# Altium schematic sheet BaseBoard.SchDoc (part 2 of 2)
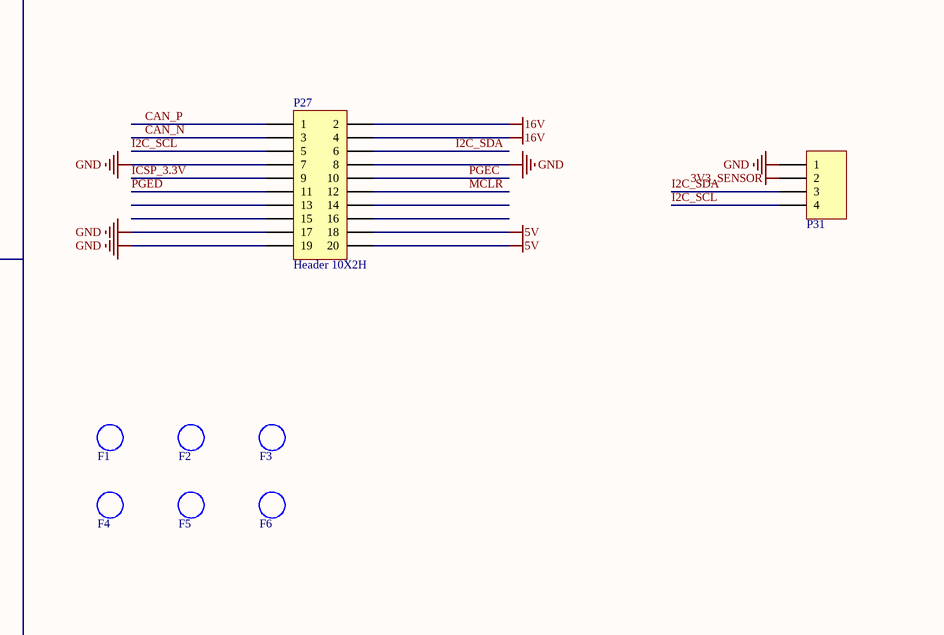
[diagram p6: BaseBoard.SchDoc, bottom right]

## Library data of the parts
C1 = CAP CER 0.1UF 50V Y5V 0603: 0.1µF -20%, +80% 50V Ceramic Capacitor Y5V (F) 0603 (1608 Metric); Manufacturer: AVX Corporation; Manufacturer Part Number: 06035G104ZAT2A; Unit Price in Quantity: .0205; Part Number: CAP CER 0.1UF 50V Y5V 0603; Component Type: Standard; Voltage - Rated: 50V; Mounting Type: smt; Supplier 1: Digikey; Supplier 1 Part Number: 478-3724-1-ND; Unit Price-Supplier 1: .11; Price Break: 1000; Vendor/Distributor: Digikey; Package: 0603
C2-C15 C18 C19 C55 = CAP CER 0.1UF 50V 10% X7R 0402: Manufacturer: TDK Corporation; Manufacturer Part Number: C1005X7R1H104K; Unit Price in Quantity: .0275; Part Number: CAP CER 0.1UF 50V 10% X7R 0402; Component Type: Standard; Mounting Type: smt; Supplier 1: Digikey; Supplier 1 Part Number: 445-5932-1-ND; Part URL-Supplier 1: http://www.digikey.com/product-detail/en/C1005X7R1H104K/445-5932-1-ND/2443972?cur=USD; Unit Price-Supplier 1: .15; Price Break: 1000; Vendor/Distributor: Digikey; DatasheetDocument: http://www.tdk.com/pdf/general_B11.pdf; Package: 0402
  C2-C15 C18 C19: Voltage - Rated: 50V
C16 C17 = CAP CERAMIC 33PF 50V NP0 0402: Manufacturer: Yageo; Manufacturer Part Number: CC0402JRNP09BN330; Unit Price in Quantity: .0019; Part Number: CAP CERAMIC 33PF 50V NP0 0402; Component Type: Standard; Voltage - Rated: 50V; Mounting Type: smt; Supplier 1: Digikey; Supplier 1 Part Number: 311-1020-1-ND; Unit Price-Supplier 1: .013; Price Break: 10000; Vendor/Distributor: Digikey; Package: 0402
C20 C21 C31 C33 C36 C39 C68 = CAP CERAMIC .01UF 50V X7R 0402: Manufacturer: Yageo; Manufacturer Part Number: CC0402KRX7R9BB103; Unit Price in Quantity: .0018; Part Number: CAP CERAMIC .01UF 50V X7R 0402; Component Type: Standard; Voltage - Rated: 50V; Mounting Type: smt; Supplier 1: Digikey; Supplier 1 Part Number: 311-1349-1-ND; Part URL-Supplier 1: http://search.digikey.com/scripts/DkSearch/dksus.dll?Detail&name=311-1349-2-ND; Unit Price-Supplier 1: .0018; Supplier 2: Digikey; Supplier 2 Part Number: GRM155R71H103KA88D; Price Break: 10000; Vendor/Distributor: Digikey; Package: 0402
C22 C35 C37 C48 = CAP CER 51PF 50V 5% NP0 0402: Manufacturer: Samsung; Manufacturer Part Number: CL05C510JB5NNNC; Unit Price in Quantity: .0117; Part Number: CAP CER 51PF 50V 5% NP0 0402; Component Type: Standard; Voltage - Rated: 50V; Mounting Type: smt; Supplier 1: Digikey; Supplier 1 Part Number: 1276-1704-1-ND; Unit Price-Supplier 1: .1; Price Break: 1000; Vendor/Distributor: Digikey; Package: 0402
C23 C41 = CAP CER 47000PF 25V X7R 0402: Manufacturer: TDK; Manufacturer Part Number: C1005X7R1E473K; Unit Price in Quantity: .0088; Part Number: CAP CER 47000PF 25V X7R 0402; Component Type: Standard; Voltage - Rated: 25V; Mounting Type: smt; Supplier 1: Digikey; Supplier 1 Part Number: 445-4941-1-ND; Unit Price-Supplier 1: .11; Price Break: 1000; Vendor/Distributor: Digikey; Package: 0402
C24 C47 = CAP 470PF 50V CERAMIC X7R 0402: Manufacturer: Yageo; Manufacturer Part Number: CC0402KRX7R9BB471; Unit Price in Quantity: .0031; Part Number: CAP 470PF 50V CERAMIC X7R 0402; Component Type: Standard; Voltage - Rated: 50V; Mounting Type: smt; Supplier 1: Digikey; Supplier 1 Part Number: 311-1028-1-ND; Unit Price-Supplier 1: .012; Price Break: 1000; Vendor/Distributor: Digikey; Package: 0402
C25-C29 C42-C46 = CAP CER 22UF 25V 20% X5R 1206: Manufacturer: Taiyo Yuden; Manufacturer Part Number: TMK316BBJ226ML-T; Unit Price in Quantity: .2169; Part Number: CAP CER 22UF 25V 20% X5R 1206; Component Type: Standard; Voltage - Rated: 25V; Mounting Type: smt; Supplier 1: Digikey; Supplier 1 Part Number: 587-3246-1-ND; Unit Price-Supplier 1: .58; Price Break: 500; Vendor/Distributor: Digikey; Package: 1210
C30 C32 C49-C51 C57-C59 C64 C71 C72 = CAP CER 1.0UF 25V X7R 0805: Manufacturer: Taiyo Yuden; Manufacturer Part Number: TMK212B7105KG-T; Unit Price in Quantity: .033; Part Number: CAP CER 1.0UF 25V X7R 0805; Component Type: Standard; Mounting Type: smt; Supplier 1: Digikey; Supplier 1 Part Number: 587-1281-1-ND; Unit Price-Supplier 1: .37; Price Break: 3000; Vendor/Distributor: Digikey; Package: 0805
  C30 C32 C71 C72: Voltage - Rated: 25V
C34 C40 = CAP CER 10UF 50V 10% X5R 1206: Manufacturer: AVX Corporation; Manufacturer Part Number: C3216X5R1H106K; Unit Price in Quantity: .396; Part Number: CAP CER 10UF 50V 10% X5R 1206; Component Type: Standard; Voltage - Rated: 50V; Mounting Type: smt; Supplier 1: Digikey; Supplier 1 Part Number: 445-5998-1-ND; Part URL-Supplier 1: http://www.digikey.com/product-detail/en/C3216X5R1H106K/445-5998-1-ND/2444039; Unit Price-Supplier 1: 1.01; Price Break: 1000; Vendor/Distributor: Digikey; DatasheetDocument: http://www.digikey.com/product-detail/en/C3216X5R1H106K/445-5998-1-ND/2444039; Package: 1206
C38 C66 = CAP CER 1UF 25V 10% X7R 0603: Manufacturer: TDK; Manufacturer Part Number: C1608X7R1E105K; Unit Price in Quantity: .0588; Part Number: CAP CER 1UF 25V 10% X7R 0603; Component Type: Standard; Mounting Type: smt; Supplier 1: Digikey; Supplier 1 Part Number: 445-5956-1-ND; Unit Price-Supplier 1: .24; Price Break: 1000; Vendor/Distributor: Digikey; Package: 0603
  C38: Voltage - Rated: 25V
C52 C60 = CAP CER 22UF 10V X5R 0805: Manufacturer: Taiyo Yuden; Manufacturer Part Number: LMK212BJ226MG-T; Unit Price in Quantity: .192; Part Number: CAP CER 22UF 10V X5R 0805; Component Type: Standard; Mounting Type: smt; Supplier 1: Digikey; Supplier 1 Part Number: 587-1958-1-ND; Part URL-Supplier 1: http://search.digikey.com/scripts/DkSearch/dksus.dll?Detail&name=587-1958-1-ND; Unit Price-Supplier 1: .96; Price Break: 3000; Vendor/Distributor: Digikey; Package: 0805
C53 C54 = CAP CERAMIC 100PF 50V NP0 0402: Manufacturer: Yageo; Manufacturer Part Number: CC0402JRNP09BN101; Unit Price in Quantity: .0032; Part Number: CAP CERAMIC 100PF 50V NP0 0402; Component Type: Standard; Mounting Type: smt; Supplier 1: Digikey; Supplier 1 Part Number: 311-1024-1-ND; Unit Price-Supplier 1: .013; Price Break: 1000; Vendor/Distributor: Digikey; Package: 0402
C56 C63 = CAP CER 10UF 25V X5R 0805: Manufacturer: Murata; Manufacturer Part Number: GRM21BR61E106KA73L; Unit Price in Quantity: .1182; Part Number: CAP CER 10UF 25V X5R 0805; Component Type: Standard; Mounting Type: smt; Supplier 1: Digikey; Supplier 1 Part Number: 490-5523-1-ND; Part URL-Supplier 1: http://www.digikey.com/product-detail/en/GRM21BR61E106KA73L/490-5523-1-ND/2334919; Unit Price-Supplier 1: .41; Price Break: 1000; Vendor/Distributor: Digikey; DatasheetDocument: http://www.murata.com/products/catalog/pdf/c02e.pdf; Package: 0805
C61 C62 = CAP CER 18PF 50V 5% NPO 0402: Manufacturer: Yageo; Manufacturer Part Number: CC0402JRNPO9BN180; Unit Price in Quantity: .0033; Part Number: CAP CER 18PF 50V 5% NPO 0402; Component Type: Standard; Mounting Type: smt; Supplier 1: Digikey; Supplier 1 Part Number: 311-1415-1-ND; Unit Price-Supplier 1: .1; Price Break: 1000; Vendor/Distributor: Digikey; Package: 0402
C65 = CAP CER 1.0UF 6.3V 10% X5R 0402: Manufacturer: Murata Electronics North America; Manufacturer Part Number: GRM155R60J105KE19D; Unit Price in Quantity: 0.006; Part Number: CAP CER 1.0UF 6.3V 10% X5R 0402; Component Type: Standard; Mounting Type: smt; Supplier 1: Digikey; Supplier 1 Part Number: 490-1320-1-ND; Part URL-Supplier 1: http://search.digikey.com/scripts/DkSearch/dksus.dll?Detail&name=490-1320-6-ND; Unit Price-Supplier 1: 0.37; Price Break: 10000; Vendor/Distributor: Digikey; Package: 0402
C67 C69 C70 = CAP CER .22UF 25V X5R 10% 0402: Manufacturer: TDK; Manufacturer Part Number: C1005X5R1E224K; Unit Price in Quantity: .03; Part Number: CAP CER .22UF 25V X5R 10% 0402; Component Type: Standard; Mounting Type: smt; Supplier 1: Digikey; Supplier 1 Part Number: 445-5944-1-ND; Unit Price-Supplier 1: .3; Price Break: 1000; Vendor/Distributor: Digikey; Package: 0402
D1 D5 D9 = 0603 绿灯: 发光二极管; ComponentLink1Description: 供应商链接; ComponentLink1URL: http://www.szlcsc.com/product/details_73152.html; Package: 0603; Supplier: LC; SuppliersPartNumber: C72043
D2 D6 D8 = 0603 蓝灯: 发光二极管; ComponentLink1Description: 供应商链接; ComponentLink1URL: http://www.szlcsc.com/product/details_73150.html; Package: 0603; Supplier: LC; SuppliersPartNumber: C72041
D3 D7 = 0603 黄灯: 发光二极管; ComponentLink1Description: 供应商链接; ComponentLink1URL: http://www.szlcsc.com/product/details_73147.html; Package: 0603; Supplier: LC; SuppliersPartNumber: C72038
D4 = 0603 红灯: 发光二极管; ComponentLink1Description: 供应商链接; ComponentLink1URL: http://www.szlcsc.com/product/details_2659.html; Package: 0603; Supplier: LC; SuppliersPartNumber: C2286
F1-F6 = Fiducial, .040": Designator: F?; Part Number: Fiducial, .040"; Component Type: Standard (No BOM)
FB1-FB4 = 0805 100Ω 25% 100MHz: 贴片磁珠; ComponentLink1Description: 供应商链接; ComponentLink1URL: http://www.szlcsc.com/product/details_1367.html; Package: 0805; Supplier: LC; SuppliersPartNumber: C1015
J1-J3 = 10117836-002LF: Usb, 3.0 Type A, Receptacle, SMT; Manufacturer: Amphenol FCI; Package: None; Manufacturer Part Number: 10117836-002LF; Digi-Key_Purchase_URL: https://www.digikey.com/product-detail/en/amphenol-fci/10117836-002LF/609-4660-ND/3641378?utm_source=snapeda&utm_medium=aggregator&utm_campaign=symbol; SnapEDA_Link: https://www.snapeda.com/parts/10117836-002LF/Amphenol%20FCI/view-part/?ref=snap; Digi-Key_Part_Number: 609-4660-ND; Value: *
L1 L2 = INDUCT ARRAY 2 COIL 3.3UH SMD: Manufacturer: Bourns Inc.; Manufacturer Part Number: SRF1280-3R3Y; Unit Price in Quantity: 1.1351; Part Number: INDUCT ARRAY 2 COIL 3.3UH SMD; Mounting Type: smt; Package: shielded; Component Type: Standard; Supplier 1: Digikey; Supplier 1 Part Number: SRF1280-3R3YCT-ND; Unit Price-Supplier 1: 1.76; Price Break: 100; Vendor/Distributor: Digikey
P1-P4 P21 P24 P25 P31 = CONN HEADER PH TOP 4POS 2MM SMD: Manufacturer: JST Sales America Inc.; Unit Price in Quantity: .3637; Part Number: CONN HEADER PH TOP 4POS 2MM SMD; Mounting Type: SMD; Package: header; Component Type: Standard; Pin Count: 4; Manufacturer Part Number: B4B-PH-SM4-TB(LF)(SN); Supplier 1: Digikey; Supplier 1 Part Number: 455-1736-1-ND; Unit Price-Supplier 1: .8; Price Break: 1000; Vendor/Distributor: Digikey
P5-P7 P13-P16 P18-P20 P23 P28-P30 = CONN HEADER PH TOP 2POS 2MM SMD: Manufacturer: JST Sales America Inc.; Unit Price in Quantity: .3467; Part Number: CONN HEADER PH TOP 2POS 2MM SMD; Mounting Type: SMD; Package: header; Component Type: Standard; Pin Count: 2; Manufacturer Part Number: B2B-PH-SM4-TB(LF)(SN); Supplier 1: Digikey; Supplier 1 Part Number: 455-1734-1-ND; Unit Price-Supplier 1: .55; Price Break: 500; Vendor/Distributor: Digikey
P8 = Header 25X2: Header, 25-Pin, Dual row; LatestRevisionDate: 17-Jul-2002; LatestRevisionNote: Re-released for DXP Platform.; Publisher: Altium Limited
P9 = CONN HEADER 2POS VL SERIES TIN: Manufacturer: JST Sales America Inc; Manufacturer Part Number: B02P-VL; Unit Price in Quantity: 0.3104; Part Number: CONN HEADER 2POS VL SERIES TIN; Mounting Type: thru-hole; Package: header; Component Type: Standard; Pin Count: 2; Supplier 1: Digikey; Supplier 1 Part Number: 455-2361-ND; Price Break: 1000; Vendor/Distributor: Digikey
P10 P12 P17 P22 P26 = CONN HEADER PH TOP 3POS 2MM SMD: Manufacturer: JST Sales America Inc.; Unit Price in Quantity: .2972; Part Number: CONN HEADER PH TOP 3POS 2MM SMD; Mounting Type: SMD; Package: header; Component Type: Standard; Pin Count: 3; Manufacturer Part Number: B3B-PH-SM4-TB(LF)(SN); Supplier 1: Digikey; Supplier 1 Part Number: 455-1735-1-ND; Unit Price-Supplier 1: .63; Price Break: 1000; Vendor/Distributor: Digikey
P11 = CONN HEADER 2POS .100" SNGL TIN: Manufacturer: Samtec Inc; Manufacturer Part Number: TSW-150-08-T-S; Unit Price in Quantity: 1.0189; Part Number: CONN HEADER 2POS .100" SNGL TIN; Mounting Type: thru-hole; Package: header; Component Type: Standard; Pin Count: 2; Supplier 1: Digikey; Supplier 1 Part Number: SAM1050-50-ND; Unit Price-Supplier 1: 2.24; Price Break: 1000; Vendor/Distributor: Digikey
P27 = Header 10X2H: Header, 10-Pin, Dual row, Right Angle; Manufacturer Part Number: AWHW 10G-0202-T; Manufacturer: Assmann WSW Components; LatestRevisionDate: 17-Jul-2002; LatestRevisionNote: Re-released for DXP Platform.; Publisher: Altium Limited
Q1 Q2 Q4 Q7 = IRF9310TRPBF: MOSFET P-CH 30V 20A 8-SOIC; Manufacturer: International Rectifier; Unit Price in Quantity: 0.7271; Part Number: IRF9310TRPBF; Mounting Type: smt; Component Kind: P Channel MOSFET; Component Type: Standard; PackageDescription: SOIC-SN8_M; Manufacturer Part Number: IRF9310TRPBF; Package: SOIC-8; Supplier 1: Digikey; Supplier 1 Part Number: IRF9310TRPBFCT-ND; Unit Price-Supplier 1: 1.94; Price Break: 1000; Vendor/Distributor: Digikey
Q3 Q5 Q6 Q8 Q9 = AO3400A N道沟 X0YV1T SOT-23: MOS(场效应管); ComponentLink1Description: 供应商链接; ComponentLink1URL: http://www.szlcsc.com/product/details_21629.html; Package: SOT-23; Supplier: LC; SuppliersPartNumber: C20917
R1-R4 = RES 49.9 OHM 1/10W 1% 0603 SMD: Manufacturer: Yageo; Manufacturer Part Number: RC0603FR-0749R9L; Unit Price in Quantity: .0027; Part Number: RES 49.9 OHM 1/10W 1% 0603 SMD; Mounting Type: smt; Package: 0603; Component Type: Standard; Supplier 1: Digikey; Supplier 1 Part Number: 311-49.9HRCT-ND; Unit Price-Supplier 1: .014; Vendor/Distributor: Digikey; Price Break: 1000
R5 R10 R11 R50 R55 R59 R61 R63 R67 R69 R70 R72 R74 R75 = RES 10K OHM 1/10W 1% 0603 SMD: Manufacturer: Stackpole Electronics Inc; Manufacturer Part Number: RMCF0603FT10K0; Unit Price in Quantity: .0023; Part Number: RES 10K OHM 1/10W 1% 0603 SMD; Mounting Type: smt; Package: 0603; Component Type: Standard; Supplier 1: Digikey; Supplier 1 Part Number: RMCF0603FT10K0CT-ND; Part URL-Supplier 1: http://search.digikey.com/scripts/DkSearch/dksus.dll?Detail&name=RMCF0603FT10K0TR-ND; Unit Price-Supplier 1: .04; Vendor/Distributor: Digikey; Price Break: 5000
R6 R7 R54 R56 = RES 12K OHM 1/10W 1% 0603 SMD: Manufacturer: Stackpole Electronics; Manufacturer Part Number: RMCF0603FT12K0; Unit Price in Quantity: .0038; Part Number: RES 12K OHM 1/10W 1% 0603 SMD; Mounting Type: smt; Package: 0603; Component Type: Standard; Supplier 1: Digikey; Supplier 1 Part Number: RMCF0603FT12K0CT-ND; Unit Price-Supplier 1: .04; Vendor/Distributor: Digikey; Price Break: 1000
R8 R42 = RES 1M OHM 1/16W 1% 0402 SMD: Manufacturer: Stackpole Electronics; Manufacturer Part Number: RMCF0402FT1M00; Unit Price in Quantity: .0038; Part Number: RES 1M OHM 1/16W 1% 0402 SMD; Mounting Type: smt; Package: 0402; Component Type: Standard; Supplier 1: Digikey; Supplier 1 Part Number: RMCF0402FT1M00CT-ND; Part URL-Supplier 1: http://search.digikey.com/scripts/DkSearch/dksus.dll?Detail&name=RMCF0402FT1M00CT-ND; Unit Price-Supplier 1: .04; Vendor/Distributor: Digikey; Price Break: 1000
R9 R22 R24 R77 R78 = RES 0.0 OHM 1/10W 0603 SMD: Manufacturer: Stackpole Electronics Inc; Manufacturer Part Number: RMCF0603ZT0R00; Unit Price in Quantity: .0015; Part Number: RES 0.0 OHM 1/10W 0603 SMD; Mounting Type: smt; Package: 0603; Component Type: Standard; Supplier 1: Digikey; Supplier 1 Part Number: RMCF0603ZT0R00CT-ND; Part URL-Supplier 1: http://search.digikey.com/scripts/DkSearch/dksus.dll?Detail&name=RMCF0603ZT0R00TR-ND; Unit Price-Supplier 1: .02; Vendor/Distributor: Digikey; Price Break: 5000
R12-R14 R31 R64 R68 R71 R73 R76 = RES 1K OHM 1/10W 1% 0603 SMD: Manufacturer: Stackpole Electronics Inc; Manufacturer Part Number: RMCF0603FT1K00; Unit Price in Quantity: .0023; Part Number: RES 1K OHM 1/10W 1% 0603 SMD; Mounting Type: smt; Package: 0603; Component Type: Standard; Supplier 1: Digikey; Supplier 1 Part Number: RMCF0603FT1K00CT-ND; Part URL-Supplier 1: http://search.digikey.com/scripts/DkSearch/dksus.dll?Detail&name=RMCF0603FT1K00TR-ND; Unit Price-Supplier 1: .04; Vendor/Distributor: Digikey; Price Break: 5000
R15 = RES SMD 120 OHM 1% 1/10W 0603: Manufacturer: Panasonic Electronic Components; Manufacturer Part Number: ERJ-3EKF1200V; Unit Price in Quantity: .0126; Part Number: RES SMD 120 OHM 1% 1/10W 0603; Mounting Type: smt; Package: 0603; Component Type: Standard; Supplier 1: Digikey; Supplier 1 Part Number: P120HCT-ND; Unit Price-Supplier 1: .1; Vendor/Distributor: Digikey; Price Break: 1000
R16 = RES 5.76K OHM 1/10W 1% 0402 SMD: Manufacturer: Panasonic - ECG; Manufacturer Part Number: ERJ-2RKF5761X; Unit Price in Quantity: .0067; Part Number: RES 5.76K OHM 1/10W 1% 0402 SMD; Mounting Type: smt; Package: 0402; Component Type: Standard; Supplier 1: Digikey; Supplier 1 Part Number: P5.76KLCT-ND; Unit Price-Supplier 1: .06; Vendor/Distributor: Digikey; Price Break: 1000
R17 R19 R27 R28 = RES 100K OHM 1/10W 1% 0603 SMD: Manufacturer: Stackpole Electronics Inc; Manufacturer Part Number: RMCF0603FT100K; Unit Price in Quantity: .0023; Part Number: RES 100K OHM 1/10W 1% 0603 SMD; Mounting Type: smt; Package: 0603; Component Type: Standard; Supplier 1: Digikey; Supplier 1 Part Number: RMCF0603FT100KCT-ND; Part URL-Supplier 1: http://search.digikey.com/scripts/DkSearch/dksus.dll?Detail&name=RMCF0603FT100KTR-ND; Unit Price-Supplier 1: .04; Vendor/Distributor: Digikey; Price Break: 5000
R18 R32 = RES 51.0K OHM 1/10W 1% 0402 SMD: Manufacturer: Panasonic - ECG; Manufacturer Part Number: ERJ-2RKF5102X; Unit Price in Quantity: .0067; Part Number: RES 51.0K OHM 1/10W 1% 0402 SMD; Mounting Type: smt; Package: 0402; Component Type: Standard; Supplier 1: Digikey; Supplier 1 Part Number: P51.0KLCT-ND; Part URL-Supplier 1: http://search.digikey.com/scripts/DkSearch/dksus.dll?Detail&name=P51.0KLCT-ND; Unit Price-Supplier 1: .06; Vendor/Distributor: Digikey; Price Break: 1000
R20 R30 = RES 42.2K OHM 1/16W 1% 0402 SMD: Manufacturer: Yageo; Manufacturer Part Number: RC0402FR-0742K2L; Unit Price in Quantity: .0027; Part Number: RES 42.2K OHM 1/16W 1% 0402 SMD; Mounting Type: smt; Package: 0402; Component Type: Standard; Supplier 1: Digikey; Supplier 1 Part Number: 311-42.2KLRCT-ND; Unit Price-Supplier 1: .014; Vendor/Distributor: Digikey; Price Break: 1000
R21 R23 = RES 2.70K OHM 1/10W 1% 0603 SMD: Manufacturer: Panasonic - ECG; Manufacturer Part Number: ERJ-3EKF2701V; Unit Price in Quantity: .0042; Part Number: RES 2.70K OHM 1/10W 1% 0603 SMD; Mounting Type: smt; Package: 0603; Component Type: Standard; Supplier 1: Digikey; Supplier 1 Part Number: P2.70KHCT-ND; Part URL-Supplier 1: http://search.digikey.com/scripts/DkSearch/dksus.dll?Detail&name=P2.70KHCT-ND; Unit Price-Supplier 1: .04; Vendor/Distributor: Digikey; Price Break: 1000
R25 = RES 43.0K OHM 1/10W 1% 0603 SMD: Manufacturer: Panasonic - ECG; Manufacturer Part Number: ERJ-3EKF4302V; Unit Price in Quantity: .002; Part Number: RES 43.0K OHM 1/10W 1% 0603 SMD; Mounting Type: smt; Package: 0603; Component Type: Standard; Supplier 1: Digikey; Supplier 1 Part Number: P43.0KHCT-ND; Part URL-Supplier 1: http://search.digikey.com/scripts/DkSearch/dksus.dll?Detail&name=P43.0KHCT-ND; Unit Price-Supplier 1: .04; Vendor/Distributor: Digikey; Price Break: 5000
R26 R62 = RES 20K OHM 1/10W 1% 0603 SMD: Manufacturer: Stackpole Electronics; Manufacturer Part Number: RMCF0603FT20K0; Unit Price in Quantity: .0038; Part Number: RES 20K OHM 1/10W 1% 0603 SMD; Mounting Type: smt; Package: 0603; Component Type: Standard; Supplier 1: Digikey; Supplier 1 Part Number: RMCF0603FT20K0CT-ND; Unit Price-Supplier 1: .04; Vendor/Distributor: Digikey; Price Break: 1000
R29 = RES 30K OHM 1/10W 1% 0603 SMD: Manufacturer: Stackpole Electronics; Manufacturer Part Number: RMCF0603FT30K0; Unit Price in Quantity: .0038; Part Number: RES 30K OHM 1/10W 1% 0603 SMD; Mounting Type: smt; Package: 0603; Component Type: Standard; Supplier 1: Digikey; Supplier 1 Part Number: RMCF0603FT30K0CT-ND; Unit Price-Supplier 1: .04; Vendor/Distributor: Digikey; Price Break: 1000
R33 R65 R66 = RES 0.0 OHM 1/8W 0805 SMD: Manufacturer: Stackpole Electronics Inc; Manufacturer Part Number: RMCF0805ZT0R00; Unit Price in Quantity: .0019; Part Number: RES 0.0 OHM 1/8W 0805 SMD; Mounting Type: smt; Package: 0805; Component Type: Standard; Supplier 1: Digikey; Supplier 1 Part Number: RMCF0805ZT0R00CT-ND; Unit Price-Supplier 1: .03; Vendor/Distributor: Digikey; Price Break: 5000
R34 = RES TF 5.76K OHM 1% 0.1W 0603: Manufacturer: Stackpole Electronics; Manufacturer Part Number: RMCF0603FT5K76; Unit Price in Quantity: .0038; Part Number: RES TF 5.76K OHM 1% 0.1W 0603; Mounting Type: smt; Package: 0603; Component Type: Standard; Supplier 1: Digikey; Supplier 1 Part Number: RMCF0603FT5K76CT-ND; Unit Price-Supplier 1: .04; Vendor/Distributor: Digikey; Price Break: 1000
R35 R48 R52 = RES 2.20K OHM 1/16W 1% 0402 SMD: Manufacturer: Yageo; Manufacturer Part Number: RC0402FR-072K2L; Unit Price in Quantity: .0027; Part Number: RES 2.20K OHM 1/16W 1% 0402 SMD; Mounting Type: smt; Package: 0402; Component Type: Standard; Supplier 1: Digikey; Supplier 1 Part Number: 311-2.20KLRCT-ND; Unit Price-Supplier 1: .1; Vendor/Distributor: Digikey; Price Break: 1000
R36 R37 = RES 698 OHM 1/8W 1% 0805 SMD: Manufacturer: Rohm Semiconductor; Manufacturer Part Number: MCR10EZPF6980; Unit Price in Quantity: .006; Part Number: RES 698 OHM 1/8W 1% 0805 SMD; Mounting Type: smt; Package: 0805; Component Type: Non-Standard; Supplier 1: Digikey; Supplier 1 Part Number: RHM698CRCT-ND; Part URL-Supplier 1: http://search.digikey.com/scripts/DkSearch/dksus.dll?Detail&name=RHM698CRCT-ND; Unit Price-Supplier 1: .038; Vendor/Distributor: Digikey; Price Break: 5000
R38 R39 = RES 22 OHM 1/10W 1% 0402 SMD: Manufacturer: Panasonic; Manufacturer Part Number: ERJ-2RKF22R0X; Unit Price in Quantity: .0054; Part Number: RES 22 OHM 1/10W 1% 0402 SMD; Mounting Type: smt; Package: 0402; Component Type: Standard; Supplier 1: Digikey; Supplier 1 Part Number: P22.0LCT-ND; Unit Price-Supplier 1: .1; Vendor/Distributor: Digikey; Price Break: 1000
R40 = RES 1.5K OHM 1/16W 1% 0402 SMD: Manufacturer: Stackpole Electronics; Manufacturer Part Number: RMCF0402FT1K50; Unit Price in Quantity: .0038; Part Number: RES 1.5K OHM 1/16W 1% 0402 SMD; Mounting Type: smt; Package: 0402; Component Type: Standard; Supplier 1: Digikey; Supplier 1 Part Number: RMCF0402FT1K50CT-ND; Part URL-Supplier 1: http://search.digikey.com/scripts/DkSearch/dksus.dll?Detail&name=RMCF0402FT1K50CT-ND; Unit Price-Supplier 1: .04; Vendor/Distributor: Digikey; Price Break: 1000
R41 R47 = RES 0.0 OHM 1/16W 0402 SMD: Manufacturer: Stackpole Electronics; Manufacturer Part Number: RMCF0402ZT0R00; Unit Price in Quantity: .0026; Part Number: RES 0.0 OHM 1/16W 0402 SMD; Mounting Type: smt; Package: 0402; Component Type: Standard; Supplier 1: Digikey; Supplier 1 Part Number: RMCF0402ZT0R00CT-ND; Part URL-Supplier 1: http://search.digikey.com/scripts/DkSearch/dksus.dll?Detail&name=RMCF0402ZT0R00CT-ND; Unit Price-Supplier 1: .02; Vendor/Distributor: Digikey; Price Break: 1000
R43-R46 = RES 3.16K OHM 1/10W 1% 0402 SMD: Manufacturer: Panasonic; Manufacturer Part Number: ERJ-2RKF3161X; Unit Price in Quantity: .0067; Part Number: RES 3.16K OHM 1/10W 1% 0402 SMD; Mounting Type: smt; Package: 0402; Component Type: Standard; Supplier 1: Digikey; Supplier 1 Part Number: P3.16KLCT-ND; Unit Price-Supplier 1: .06; Vendor/Distributor: Digikey; Price Break: 1000
R49 = RES 49.9K OHM 1/10W 1% 0603 SMD: Manufacturer: Yageo; Manufacturer Part Number: RC0603FR-0749K9L; Unit Price in Quantity: .0027; Part Number: RES 49.9K OHM 1/10W 1% 0603 SMD; Mounting Type: smt; Package: 0603; Component Type: Standard; Supplier 1: Digikey; Supplier 1 Part Number: 311-49.9KHRCT-ND; Unit Price-Supplier 1: .014; Vendor/Distributor: Digikey; Price Break: 1000
R51 R53 R58 R60 = RES 10K OHM 1/16W 1% 0402 SMD: Manufacturer: Stackpole Electronics; Manufacturer Part Number: RMCF0402FT10K0; Unit Price in Quantity: 0.0038; Part Number: RES 10K OHM 1/16W 1% 0402 SMD; Mounting Type: smt; Package: 0402; Component Type: Standard; Supplier 1: Digikey; Supplier 1 Part Number: RMCF0402FT10K0CT-ND; Part URL-Supplier 1: http://search.digikey.com/scripts/DkSearch/dksus.dll?Detail&name=RMCF0402FT10K0CT-ND; Unit Price-Supplier 1: 0.04; Vendor/Distributor: Digikey; Price Break: 1000
R57 = RES 100K OHM 1/16W 1% 0402 SMD: Manufacturer: Stackpole Electronics; Manufacturer Part Number: RMCF0402FT100K; Unit Price in Quantity: 0.0038; Part Number: RES 100K OHM 1/16W 1% 0402 SMD; Mounting Type: smt; Package: 0402; Component Type: Standard; Supplier 1: Digikey; Supplier 1 Part Number: RMCF0402FT100KCT-ND; Part URL-Supplier 1: http://search.digikey.com/scripts/DkSearch/dksus.dll?Detail&name=RMCF0402FT100KCT-ND; Unit Price-Supplier 1: 0.04; Vendor/Distributor: Digikey; Price Break: 1000
TP1-TP8 = Test Point, 60mil: Designator: TP?; Part Number: Test Point, 60mil; Component Type: Standard (No BOM)
U1 = LAN9500AI-ABZJ-T: Imported; Manufacturer_Part_Number: LAN9500AI-ABZJ-TR; Vendor: Microchip; Built_By: EMA_UL_Team; C: Copyright (C) 2015 Accelerated Designs. All rights reserved; RefDes: RefDes; Type: DEV; Value: Value
U2 = CAN/TJA1050T/CM_[C6952]: CAN; ComponentLink1Description: 供应商链接; ComponentLink1URL: http://www.szlcsc.com/product/details_7424.html; Package: SOIC-8_150mil; Supplier: LC; SuppliersPartNumber: C6952
U3 = 93AA56AT-I/OT: Imported; Vendor: Microchip; Built_By: EMA_UL_Team; C: Copyright (C) 2015 Accelerated Designs. All rights reserved; Manufacturer_Part_Number: 93AA56AT-I/OT; RefDes: RefDes; Type: DEV; Value: Value
U4 = TPS65279DAP: IC REG BUCK ADJ 5A DL 32HTSSOP; Manufacturer: Texas Instruments; Unit Price in Quantity: 2.411; Part Number: TPS65279DAP; Component Type: Standard; Pin Count: 33; Manufacturer Part Number: TPS65279DAPR; Mounting Type: smt; Package: 32-HTSSOP; Supplier 1: Digikey; Supplier 1 Part Number: 296-40890-1-ND; Unit Price-Supplier 1: 4.56; Price Break: 1000; Vendor/Distributor: Digikey
U5 = PCM2912A: IC STEREO AUD CODEC W/USB 32TQFP; Manufacturer: Texas Instruments; Manufacturer Part Number: PCM2912APJTR; Unit Price in Quantity: 6.345; Part Number: PCM2912A; Component Type: Standard; Datasheet: http://www.ti.com/lit/gpn/PCM2912A; Pin Count: 32; Mounting Type: SMT; Package: 32-TQFP; Supplier 1: Digikey; Supplier 1 Part Number: 296-39145-6-ND; Unit Price-Supplier 1: 11.52; Price Break: 1000; Vendor/Distributor: Digikey
U6 U8 = DSUB25_M_WDB951-PM25G: Manufacturer: MMT Machrone; Part Number: DSUB25_M_WDB951-PM25G; Mounting Type: thru-hole; Package: header; Component Type: Standard; Pin Count: 25; Manufacturer Part Number: WDB951-PM25G; Supplier 1: MMT Machrone; Supplier 1 Part Number: WDB951-PM25G
U7 = MCP6002T-I/MS: IC OPAMP 1.8V 1MHZ DUAL 8-MSOP; Manufacturer: Microchip; Unit Price in Quantity: 0.25; FirstPublished: 29-Jan-2009; LatestRevisionDate: 02-Dec-2009; LatestRevisionNote: Updated to datasheet revision J, Nov-2009; DatasheetVersion: revJ, Nov-2009; PackageVersion: revBB, Aug-2009; PackageReference: MSOP-MS8; Publisher: Altium Limited; PackageDescription: 8-Lead Plastic Micro Small Outline Package (MS) [MSOP]; Supplier 1: Digikey; Supplier Part Number 1: MCP6002T-I/MSTR-ND; Supplier Part Number 2: MCP6002T-I/MSCT-ND; Supplier Part Number 3: MCP6002T-I/MSDKR-ND; Supplier 4: Newark; Supplier Part Number 4: 72C4273; ComponentLink1Description: Datasheet; ComponentLink1URL: http://ww1.microchip.com/downloads/en/DeviceDoc/21733j.pdf; ComponentLink2Description: Packaging Specification; ComponentLink2URL: http://www.microchip.com/stellent/groups/techpub_sg/documents/packagingspec/en012702.pdf; ComponentLink3Description: Microchip.com Home; ComponentLink3URL: http://www.microchip.com/; Part Number: MCP6002T-I/MS; Component Type: Standard; Pin Count: 8; Manufacturer Part Number: MCP6002T-I/MS; Mounting Type: smt; Package: 8-MSOP; Supplier 1 Part Number: MCP6002T-I/MSCT-ND; Unit Price-Supplier 1: .41; Price Break: 100; Vendor/Distributor: Digikey
U9 = TPA6211A1DRBR: IC AMP AUDIO PWR 3.1W MONO 8SON; Manufacturer: Texas Instruments; Unit Price in Quantity: .4697; Part Number: TPA6211A1DRBR; Component Type: Standard; Pin Count: 9; Manufacturer Part Number: TPA6211A1DRBR; Mounting Type: smt; Package: 8-VDFN Exposed Pad; Supplier 1: Digikey; Supplier 1 Part Number: 296-17101-1-ND; Unit Price-Supplier 1: 1.03; Price Break: 1000; Vendor/Distributor: Digikey
U10 = Temperature Sensor Analog, Local -40°C ~ 125°C 10mV/°C SOT-23-3: Manufacturer: Texas Instruments; Unit Price in Quantity: .5739; Part Number: Temperature Sensor Analog, Local -40°C ~ 125°C 10mV/°C SOT-23-3; Component Type: Standard; Datasheet: http://www.ti.com/lit/ds/symlink/lm50.pdf; Pin Count: 3; Manufacturer Part Number: LM50CIM3/NOPB; Mounting Type: smt; Package: SOT-23-3; Supplier 1: Digikey; Supplier 1 Part Number: LM50CIM3/NOPBCT-ND; Unit Price-Supplier 1: 1.29; Price Break: 500; Vendor/Distributor: Digikey
U11 = ULN2803ADW_[C9683]: 大电流驱动; ComponentLink1Description: 供应商链接; ComponentLink1URL: http://www.szlcsc.com/product/details_10213.html; Package: SOIC-18_300mil; Supplier: LC; SuppliersPartNumber: C9683
VR1 VR2 = AZ1117EH-3.3TRG1: IC REG LINEAR 3.3V 1A SOT223; Manufacturer: Diodes Incorporated; Unit Price in Quantity: .1002; Part Number: AZ1117EH-3.3TRG1; Component Type: Standard; Datasheet: https://www.diodes.com/assets/Datasheets/AZ1117E.pdf; Pin Count: 4; Manufacturer Part Number: AZ1117EH-3.3TRG1; Mounting Type: smt; Package: SOT-23; Supplier 1: Digikey; Supplier 1 Part Number: AZ1117EH-3.3TRG1DICT-ND; Unit Price-Supplier 1: 0.44; Price Break: 1000; Vendor/Distributor: Digikey
Y1 = SMD-3225_4P  25MHZ 12PF 10PPM: 贴片晶振; ComponentLink1Description: 供应商链接; ComponentLink1URL: http://www.szlcsc.com/product/details_9526.html; Package: SMD-3225_4P; Supplier: LC; SuppliersPartNumber: C9006
Y2 = ABMM-6.000MHZ-B2-T: CRYSTAL 6.0000MHZ 18PF SMD; Manufacturer: Abracon LLC; Unit Price in Quantity: .41; Part Number: ABMM-6.000MHZ-B2-T; Mounting Type: smt; Package: SMD-7050_4P; Component Type: Standard; Manufacturer Part Number: ABMM-6.000MHZ-B2-T; Supplier 1: Digikey; Supplier 1 Part Number: 535-10156-1-ND; Unit Price-Supplier 1: .79; Price Break: 1000; Vendor/Distributor: Digikey